# Altium schematic sheet DebuggerMCU.SchDoc
size A4
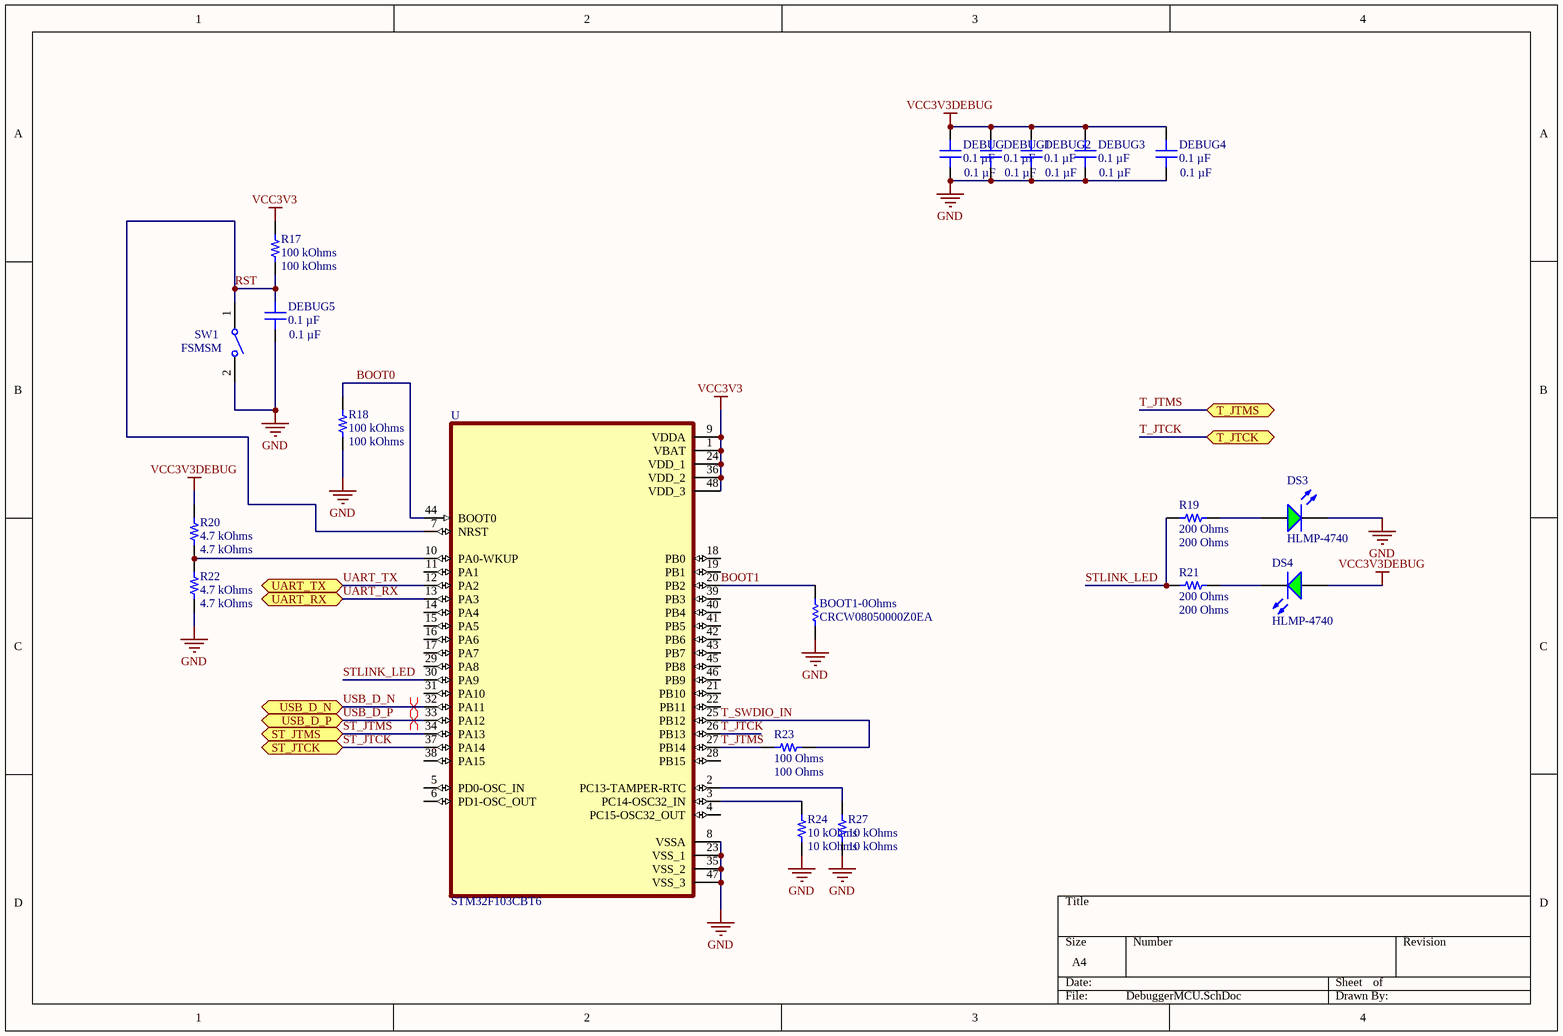
[diagram p0: DebuggerMCU.SchDoc]

## Parts
BOOT1-0Ohms  CRCW08050000Z0EA  [RESC2013X50X30LL20T20]
DEBUG  0.1 µF  [CAP 0805_2012]
DEBUG1  0.1 µF  [CAP 0805_2012]
DEBUG2  0.1 µF  [CAP 0805_2012]
DEBUG3  0.1 µF  [CAP 0805_2012]
DEBUG4  0.1 µF  [CAP 0805_2012]
DEBUG5  0.1 µF  [CAP 0805_2012]
DS3  HLMP-4740  [AVAG-HLMP-4740]
DS4  HLMP-4740  [AVAG-HLMP-4740]
R17  100 kOhms  [RES 0805_2012]
R18  100 kOhms  [RES 0805_2012]
R19  200 Ohms  [RES 0805_2012]
R20  4.7 kOhms  [RES 0805_2012]
R21  200 Ohms  [RES 0805_2012]
R22  4.7 kOhms  [RES 0805_2012]
R23  100 Ohms  [RES 0805_2012]
R24  10 kOhms  [RES 0805_2012]
R27  10 kOhms  [RES 0805_2012]
SW1  FSMSM  [TECO-FSMSM-2_V]
U  STM32F103CBT6  [QFP50P900X900X160-48N]

## Ports
ST_JTCK (bidir), ST_JTMS (bidir), T_JTCK (bidir), T_JTMS (bidir), UART_RX (bidir), UART_TX (bidir), USB_D_N (bidir), USB_D_P (bidir)

## Nets
GND: BOOT1-0Ohms.1 DEBUG.1 DEBUG1.1 DEBUG2.1 DEBUG3.1 DEBUG4.1 DEBUG5.1 DS3.2(K) R18.1 R22.1 R24.1 R27.1 SW1.2 U.8(VSSA) U.23(VSS_1) U.35(VSS_2) U.47(VSS_3)
VCC3V3: R17.2 U.1(VBAT) U.9(VDDA) U.24(VDD_1) U.36(VDD_2) U.48(VDD_3)
VCC3V3DEBUG: DEBUG.2 DEBUG1.2 DEBUG2.2 DEBUG3.2 DEBUG4.2 DS4.1(A) R20.2
BOOT0: R18.2 U.44(BOOT0)
BOOT1: BOOT1-0Ohms.2 U.20(PB2)
RST: DEBUG5.2 R17.1 SW1.1 U.7(NRST)
ST_JTCK: U.37(PA14) ; port ST_JTCK
ST_JTMS: U.34(PA13) ; port ST_JTMS
STLINK_LED: R19.1 R21.1 U.30(PA9)
T_JTCK: U.26(PB13) ; port T_JTCK
T_JTMS: R23.1 U.27(PB14) ; port T_JTMS
T_SWDIO_IN: R23.2 U.25(PB12)
UART_RX: U.13(PA3) ; port UART_RX
UART_TX: U.12(PA2) ; port UART_TX
USB_D_N: U.32(PA11) ; port USB_D_N
USB_D_P: U.33(PA12) ; port USB_D_P
NetDS3_1: DS3.1(A) R19.2
NetDS4_2: DS4.2(K) R21.2
NetR20_1: R20.1 R22.2 U.10(PA0-WKUP)
NetR24_2: R24.2 U.3(PC14-OSC32_IN)
NetR27_2: R27.2 U.2(PC13-TAMPER-RTC)

Not connected (* = marked no-connect by the designer): U 4(PC15-OSC32_OUT) 5(PD0-OSC_IN) 6(PD1-OSC_OUT) 11(PA1) 14(PA4) 15(PA5) 16(PA6) 17(PA7) 18(PB0) 19(PB1) 21(PB10) 22(PB11) 28(PB15) 29(PA8) 31(PA10) 38(PA15) 39(PB3) 40(PB4) 41(PB5) 42(PB6) 43(PB7) 45(PB8) 46(PB9)

## Layout directives
differential pair: USB_D_N, USB_D_P

## Library data of the parts
BOOT1-0Ohms = CMP-2001-04896-1: Manufacturer: Vishay Dale; Part Number: CRCW08050000Z0EA
DEBUG DEBUG1-DEBUG5 = CC0805MRX7R9BB104: CAP CER 0.1UF 50V X7R 0805; Part Number: CC0805MRX7R9BB104; Value: 0.1 µF
DS3 DS4 = CMP-2000-06413-1: T-1 3/4 (5 mm) Low Current LED Lamp, Green, 1.9 V, -20 to 100 degC, 2-Pin THD, RoHS, Bulk; Manufacturer: AvagoTechnologies; Type: Uni-Color; Peak Wavelength: 565nm; Rad Hard: No; Viewing Angle: 50°; Dominant Wavelength/Color Temperature: 569nm; Number of LEDs: 1; Lens Appearance: ColoredDiffused; Lens Shape Type: Circular; Mounting Orientation: TopMount; Intensity: 2.3mcd; Datasheet Version: 07/2014; Category: LEDs; Datasheet URL: http://docs.avagotech.com/docs/AV02-1557EN; Packaging: Bulk; Pin Count: 2; Mounting Technology: ThroughHole; Package Reference: HLMP-4740; Mounting: ThroughHole; Manufacturer URL: http://www.avagotech.com/; Color: Green; Package: 2T-13/4; Package Description: 2-Pin Through Hole Device, Dia 5.845 mm, Pitch 2.54 mm
R17 R18 = CPF0805B100KE: RES SMD 100K OHM 0.1% 1/10W 0805; Part Number: CPF0805B100KE; Value: 100 kOhms
R19 R21 = ERJ-PB6D2000V: RES SMD 200 OHM 0.5% 1/4W 0805; Part Number: ERJ-PB6D2000V; Value: 200 Ohms
R20 R22 = RCS08054K70JNEA: RES SMD 4.7K OHM 5% 1/2W 0805; Part Number: RCS08054K70JNEA; Value: 4.7 kOhms
R23 = RCS0805100RFKEA: RES SMD 100 OHM 1% 1/2W 0805; Part Number: RCS0805100RFKEA; Value: 100 Ohms
R24 R27 = RNCS0805BKE10K0: RES 10K OHM 0.1% 1/10W 0805; Part Number: RNCS0805BKE10K0; Value: 10 kOhms
SW1 = CMP-2000-07511-1: FSMSM Push Button Switch, 50 mA, -35 to 85 degC, 2-Pin SMD, RoHS, Bulk; Manufacturer: TE Connectivity; Actuator Length: 1.07mm; Electrical Life: 20000Cycles; Actuator Material: Polyamide; Current Rating: 50mA; Illumination Type: Illuminated; Voltage Rating (DC): 24V; Contact Resistance: 100mOhm; Case\/Package: SMD/SMT; Operating Force: 180gf; Switch Travel: 0.25mm; Max Voltage Rating (DC): 12V; Throw Configuration: SPST; Packaging: LoosePiece; Max Operating Temperature: 85degC; ELV: Compliant; Package Description: 2-Pin Surface Mount Device, Body 6 x 3.5 mm, Pitch 9.19 mm; RoHSCompliant: true; Manufacturer URL: http://www.te.com/; Contact Plating: Silver; Contact Material: Brass; Mounting Technology: SurfaceMount; Contact Current Rating: 50mA; Datasheet Version: Rev. C2, 08/2014; Datasheet URL: http://www.te.com/commerce/DocumentDelivery/DDEController?Action=showdoc&DocId=Customer+Drawing%7F1437566-3%7FC2%7Fpdf%7FEnglish%7FENG_CD_1437566-3_C2_1437566_3_1_c.dwg.pdf%7F1437566-3; Mechanical Life: 20000Cycles; Package Reference: FSMSM; REACH SVHC: Unknown; Orientation: Straight; Min Operating Temperature: -35degC; Lead Free: LeadFree; Termination: GullWing; Package Quantity: 1000; Mount: SurfaceMount
U = STM32F103CBT6: ARMÂ® CortexÂ®-M3 STM32F1 Microcontroller IC 32-Bit 72MHz 128KB _128K x 8_ FLASH; MF: STMicroelectronics; Package: LQFP-48 STMicroelectronics; Availability: Unavailable; MP: STM32F103CBT6; Value: *; SnapEDA_Link: https://www.snapeda.com/parts/STM32F103CBT6/STMicroelectronics/view-part/38865/?ref=snap; Price: None